# EAGLE schematic fan5245-mk-1.0 (EAGLE 7.5.0)
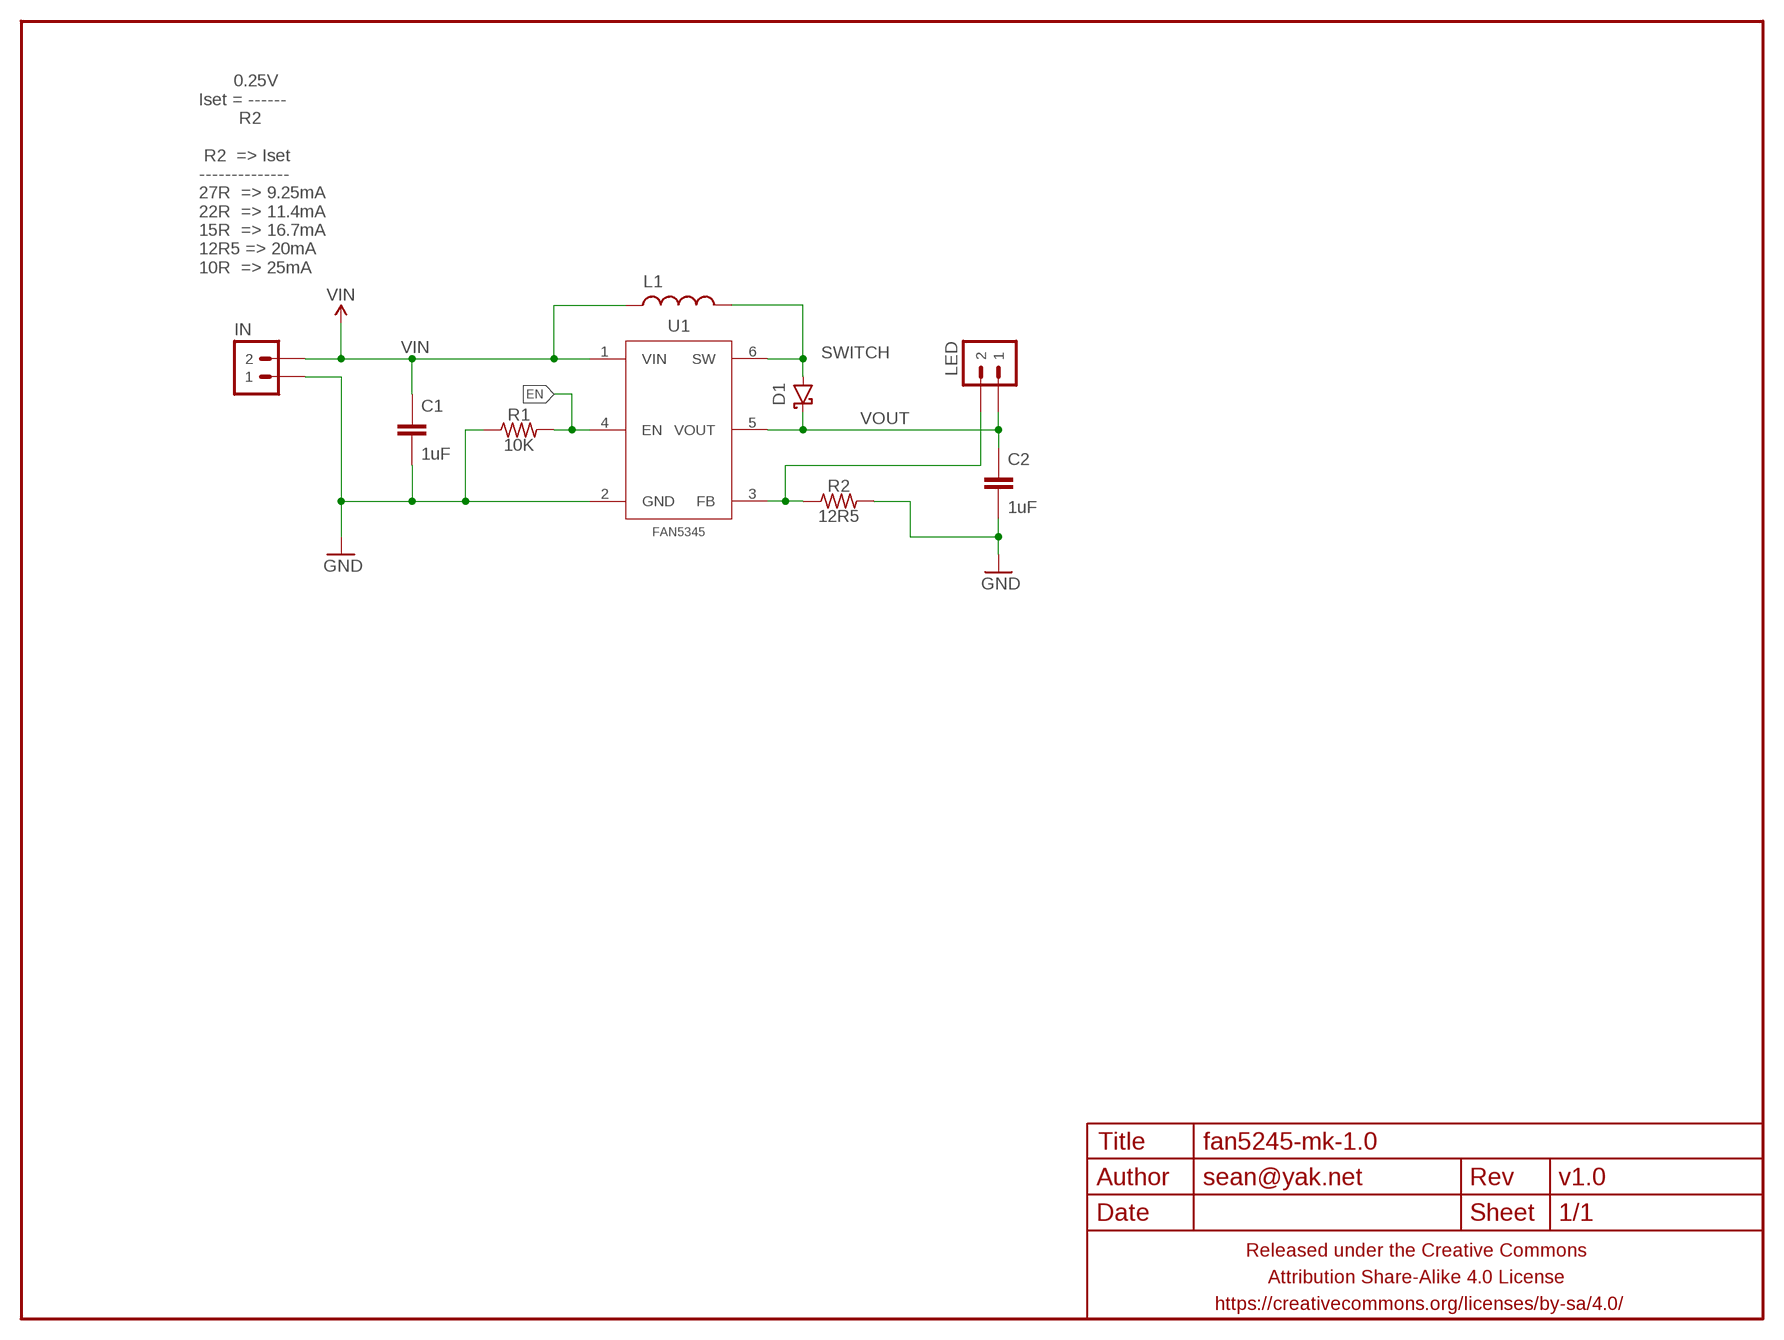
[diagram p0: schematic, sheet 1]

## Parts
C1  1uF  CAPACITOR-CERAMICC0603-TIGHTER  [C0603-TIGHTER]
C2  1uF  CAPACITOR-CERAMICC0603-TIGHTER  [C0603-TIGHTER]
D1  DIODE-SCHOTTKYSOD323  [SOD323-SCHOTTKY]
FRAME1  FRAME-LETTERNO_PACKAGE  [DUMMY]
IN  M02PTH-CENTERED-R+  [1X02-CENTER-R+]
L1  10uH  INDUCTOR0603-TIGHTER  [L0603]
LED  M02PTH-CENTERED-L+  [1X02-CENTER-L+]
R1  10K  RESISTORR0603-TIGHTER  [R0603-TIGHTER]
R2  12R5  RESISTORR0603-TIGHTER  [R0603-TIGHTER]
U1  FAN5345  FAN5345SSOT23  [SOT23-6]

## Nets
EN: R1.2 U1.4(EN)
GND: C1.2 C2.2 IN.1 R1.1 R2.2 U1.2(GND)
N$1: LED.2 R2.1 U1.3(FB)
SWITCH: D1.A L1.2 U1.6(SW)
VIN: C1.1 IN.2 L1.1 U1.1(VIN)
VOUT: C2.1 D1.C LED.1 U1.5(VOUT)

## Notes on the sheet
- 0.25V
  Iset = ------
          R2
  
   R2  => Iset
  --------------
  27R  => 9.25mA
  22R  => 11.4mA
  15R  => 16.7mA
  12R5 => 20mA
  10R  => 25mA

## Library data of the parts
C1 C2 = a_parts:CAPACITOR-CERAMIC: CAPACITOR, European symbol
D1 = a_parts:DIODE-SCHOTTKY: Schottky diodes in SFE's production catalog BAT20J 1A 23V 0.62Vf RB751 120mA 40V 0.37Vf PMEG4005EJ 0.5A 40V 0.42Vf MBRA140 1A 40V 0.5Vf B340A 3A 40V SMA
FRAME1 = a_parts:FRAME-LETTER: Schematic Frame Standard 8.5x11 US Letter frame; DESIGNER: sean@yak.net; VERSION: v1.0
IN LED = a_parts:M02: Standard 2-pin 0.1" header. Use with - straight break away headers ( PRT-00116) - right angle break away headers (PRT-00553) - swiss pins (PRT-00743) - machine pins (PRT-00117) - female headers (PRT-00115) Molex polarized connector foot print use with: PRT-08233 with associated crimp pins and housings. 2.54_SCREWTERM for use with PRT-10571. 3.5mm Screw Terminal footprints for PRT-08084 5mm Screw Terminal footprints for use with PRT-08433
L1 = a_parts:INDUCTOR: Inductors Basic Inductor/Choke - 0603 and 1206. Footprints are not proven and vary greatly between part numbers. SRN6045- 33uH, 20% 1.4A SDR0403-560KL - 56uH, 10%, 500mA RMS/740mA peak
R1 R2 = a_parts:RESISTOR: RESISTOR, American symbol
U1 = a_parts:FAN5345